# EAGLE schematic chessbot1final (EAGLE 7.5.0)
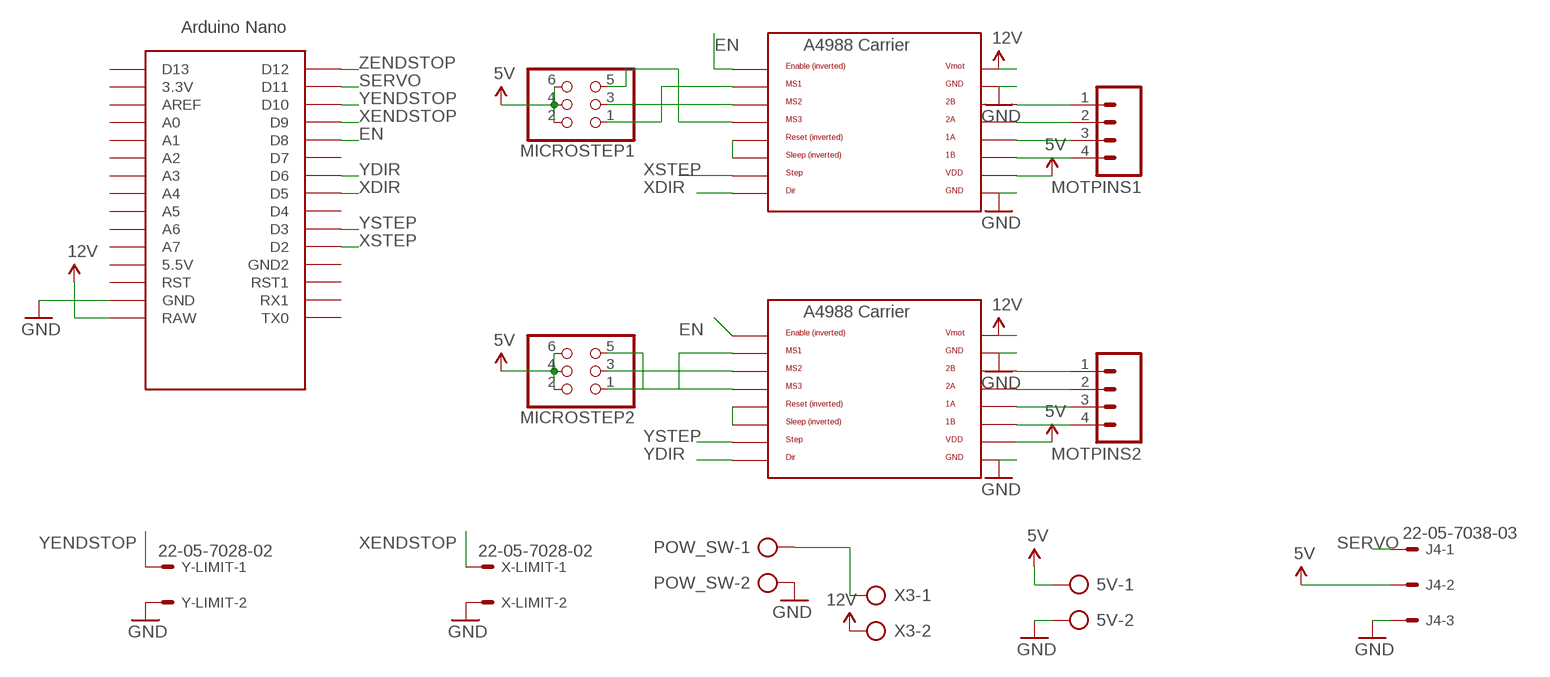
[diagram p0: schematic, sheet 1]

## Parts
5V  AK500/2  [AK500/2]
J4  22-05-7038-03  [7395-03]
MICROSTEP1  PINHD-2X3  [2X03]
MICROSTEP2  PINHD-2X3  [2X03]
MOTPINS1  M04PTH  [1X04]
MOTPINS2  M04PTH  [1X04]
POW_SW  AK500/2  [AK500/2]
U$1  A4988BREAKOUT  [A4988BREAKOUT]
U$2  A4988BREAKOUT  [A4988BREAKOUT]
U$3  NANO  [NANO]
X3  AK500/2  [AK500/2]
X-LIMIT  22-05-7028-02  [7395-02]
Y-LIMIT  22-05-7028-02  [7395-02]

## Nets
5V: 5V.1 J4.2 MICROSTEP1.2 MICROSTEP1.4 MICROSTEP1.6 MICROSTEP2.2 MICROSTEP2.4 MICROSTEP2.6 U$1.VDD U$2.VDD
12V: U$1.VMOT U$2.VMOT U$3.RAW X3.2
EN: U$1.EN U$2.EN U$3.D8
GND: 5V.2 J4.3 POW_SW.2 U$1.GND U$1.GND@0(GND) U$2.GND U$2.GND@0(GND) U$3.GND X-LIMIT.2 Y-LIMIT.2
N$1: MOTPINS1.4 U$2.1B
N$2: MOTPINS1.3 U$2.1A
N$3: MOTPINS1.2 U$2.2A
N$4: MOTPINS1.1 U$2.2B
N$5: MOTPINS2.1 U$1.2B
N$6: MOTPINS2.2 U$1.2A
N$7: MOTPINS2.3 U$1.1A
N$8: MOTPINS2.4 U$1.1B
N$9: MICROSTEP1.1 U$2.MS1
N$10: MICROSTEP1.3 U$2.MS2
N$11: U$2.RST U$2.SLP(SLEEP)
N$12: MICROSTEP2.3 U$1.MS2
N$13: MICROSTEP2.1 U$1.MS1
N$14: MICROSTEP2.5 U$1.MS3
N$15: POW_SW.1 X3.1
N$16: MICROSTEP1.5 U$2.MS3
N$26: U$1.RST U$1.SLP(SLEEP)
SERVO: J4.1 U$3.D11
XDIR: U$2.DIR U$3.D5
XENDSTOP: U$3.D9 X-LIMIT.1
XSTEP: U$2.STEP U$3.D2
YDIR: U$1.DIR U$3.D6
YENDSTOP: U$3.D10 Y-LIMIT.1
YSTEP: U$1.STEP U$3.D3
ZENDSTOP: U$3.D12
Unconnected: U$3.3.3V U$3.5V(5.5V) U$3.A0 U$3.A1 U$3.A2 U$3.A3 U$3.A4 U$3.A5 U$3.A6 U$3.A7 U$3.AREF U$3.D4 U$3.D7 U$3.D13 U$3.GND1(GND2) U$3.ICSP1 U$3.ICSP2 U$3.ICSP3 U$3.ICSP4 U$3.ICSP5 U$3.ICSP6 U$3.RST U$3.RST1 U$3.RX1 U$3.TX0

## Library data of the parts
5V POW_SW X3 = con-ptr500:AK500/2: CONNECTOR; OC_FARNELL: unknown; OC_NEWARK: unknown
J4 = con-molex:22-?-03: CONNECTOR wire to board 2.54 mm (.1 inch) pitch header; OC_FARNELL: unknown; OC_NEWARK: unknown
MICROSTEP1 MICROSTEP2 = pinhead:PINHD-2X3: PIN HEADER
MOTPINS1 MOTPINS2 = SparkFun-Connectors:M04: Header 4 Standard 4-pin 0.1" header. Use with straight break away headers (SKU : PRT-00116), right angle break away headers (PRT-00553), swiss pins (PRT-00743), machine pins (PRT-00117), and female headers (PRT-00115). Molex polarized connector foot print use with SKU : PRT-08231 with associated crimp pins and housings. 1MM SMD Version SKU: PRT-10208; PROD_ID: CONN-09696
U$1 U$2 = RepRapjr:A4988BREAKOUT
U$3 = Arduino-clone:NANO: Arduino Nano
X-LIMIT Y-LIMIT = con-molex:22-?-02: CONNECTOR wire to board 2.54 mm (.1 inch) pitch header; OC_FARNELL: 9731601; OC_NEWARK: unknown